# Altium schematic sheet CMC.schdoc
size 124 x 99 mm
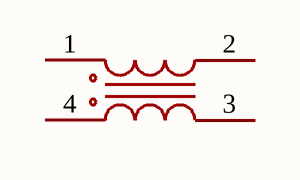
[diagram p0: CMC.schdoc]

## Parts
L?  CMF4532F-900-2P-Tms  [FILTER-SMD_4P-L4.5-W3.2-BL_CMF4532F]  (value not drawn)

## Nets

Not connected (* = marked no-connect by the designer): L? 1 2 3 4

## Library data of the parts
L? = CMF4532F-900-2P-Tms: Manufacturer: EMTEK(兆欣); Add into BOM: yes; Number of Lines: 2; Withstanding Voltage: 12.5V; Current Rating: 2A; Voltage Rating - DC: 50V; Impedance @ Frequency: 90Ω@100MHz; DC Resistance (DCR): 50mΩ; Symbol: CMF4532F-900-2P-TMS; Device: CMF4532F-900-2P-Tms; LCSC Part Name: 两路 贴片共模滤波器 阻抗90Ω@100MHz; Supplier Part: C252150; Manufacturer Part: CMF4532F-900-2P-Tms; Supplier Footprint: SMD,4.5x3.2x2.8mm; JLCPCB Part Class: Extended Part; Datasheet: https://atta.szlcsc.com/upload/public/pdf/source/20190322/C252150_370767FB0BF4DE5D3F867A1ABBD704E0.pdf; Supplier: LCSC; Convert to PCB: yes; Operating Temperature: -40℃~+125℃